# Altium schematic sheet CATS-GS-Overview.SchDoc: CATS Groundstation
size A4; DocumentNumber: Overview; Revision: V1.0; SheetNumber: 1; SheetTotal: 9; Author: Luca Jost; Subtitle: Overview
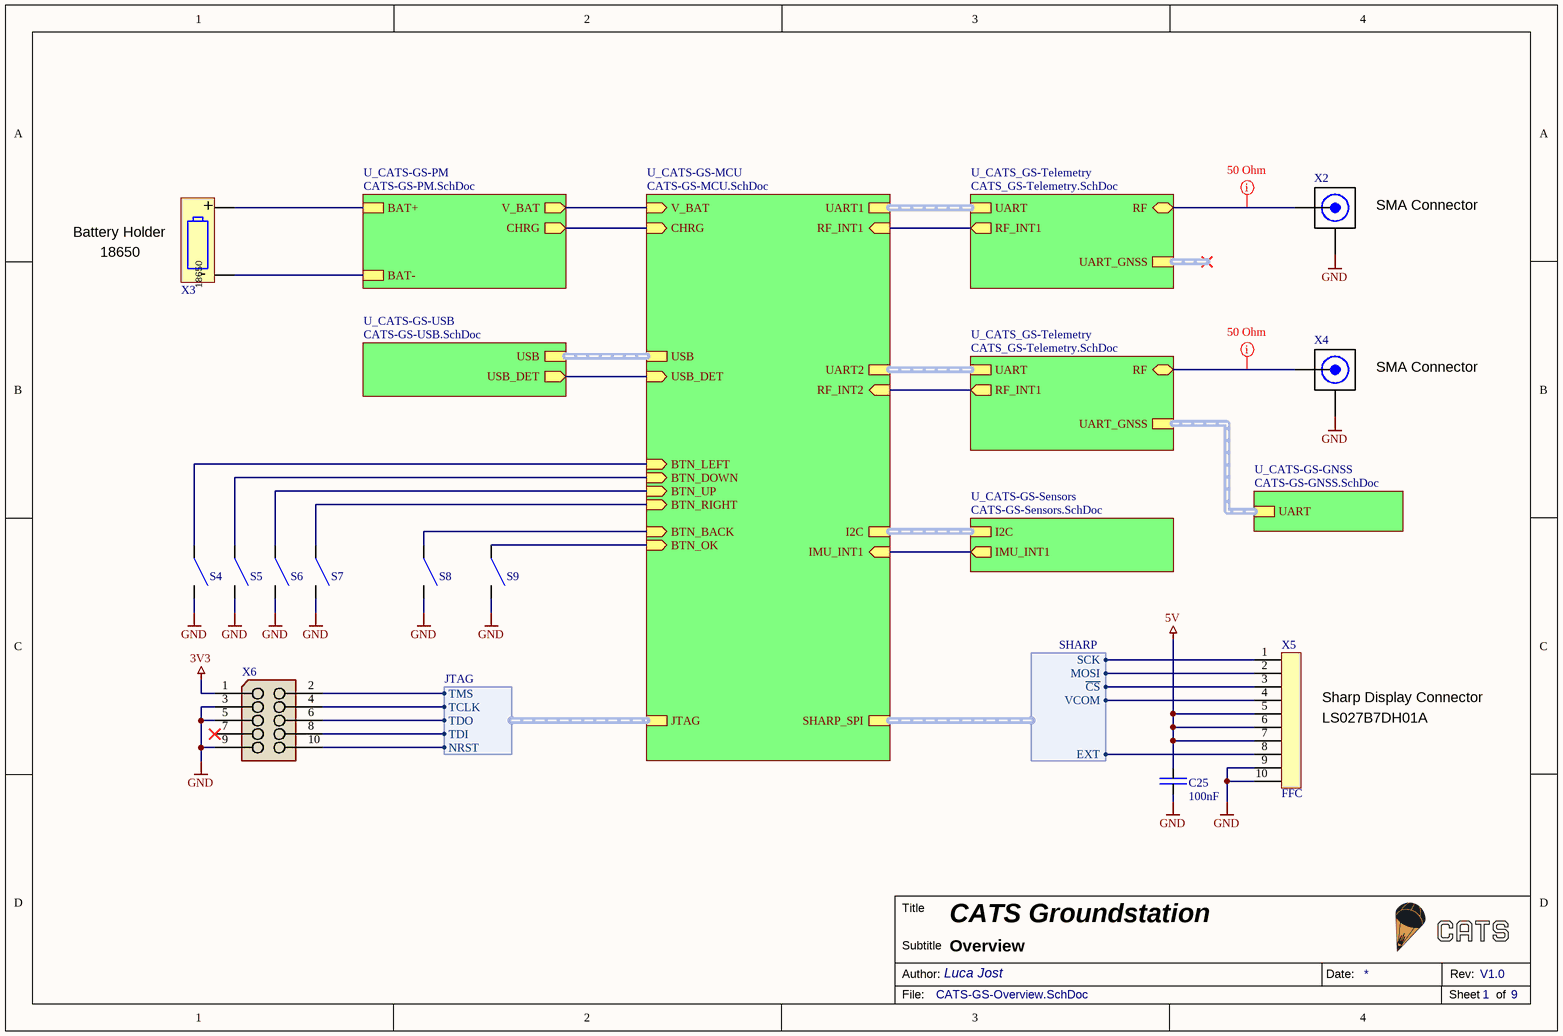
[diagram p0: CATS-GS-Overview.SchDoc]

## Parts
C25  100nF  [SMD Keramikkondensator 0402]
S4  SMD-Button  [SMD Button 4.2x3.2]  (value not drawn)
S5  SMD-Button  [SMD Button 4.2x3.2]  (value not drawn)
S6  SMD-Button  [SMD Button 4.2x3.2]  (value not drawn)
S7  SMD-Button  [SMD Button 4.2x3.2]  (value not drawn)
S8  SMD-Button  [SMD Button 4.2x3.2]  (value not drawn)
S9  SMD-Button  [SMD Button 4.2x3.2]  (value not drawn)
X2  SMA Connector  [SMD Connector SMA]  (value not drawn)
X3  18650  [SMD 18650 Batttery Holder]  (value not drawn)
X4  SMA Connector  [SMD Connector SMA]  (value not drawn)
X5  FFC  [SMD Connector FFC/FPC 10Pin / 0.5mm Pitch]
X6  JTAG-Header (ARM-Cortex)  [SMD Connector 1.27mm (2x5)]  (value not drawn)

## Sub-sheets
U_CATS-GS-GNSS = CATS-GS-GNSS.SchDoc: UART (harness UART)
U_CATS-GS-MCU = CATS-GS-MCU.SchDoc: SHARP_SPI (harness SHARP), USB (harness USB), JTAG (harness JTAG), UART2 (harness UART), UART1 (harness UART), RF_INT1 (in), RF_INT2 (in), I2C, IMU_INT1 (in), USB_DET (in), CHRG (in), V_BAT (in), BTN_OK (in), BTN_BACK (in), BTN_RIGHT (in), BTN_UP (in), BTN_DOWN (in), BTN_LEFT (in)
U_CATS-GS-PM = CATS-GS-PM.SchDoc: BAT+, BAT-, V_BAT (out), CHRG (out)
U_CATS-GS-Sensors = CATS-GS-Sensors.SchDoc: I2C (harness I2C), IMU_INT1 (out)
U_CATS-GS-USB = CATS-GS-USB.SchDoc: USB (harness USB), USB_DET (out)
U_CATS_GS-Telemetry = CATS_GS-Telemetry.SchDoc: UART, RF_INT1 (out), UART_GNSS, RF (bidir)
U_CATS_GS-Telemetry = CATS_GS-Telemetry.SchDoc: UART, RF_INT1 (out), UART_GNSS, RF (bidir)

## Harnesses
JTAG: TMS, TDI, TDO, TCLK, NRST
SHARP: MOSI, ~{CS}, SCK, VCOM, EXT

## Nets
3V3: X6.1
5V: C25.2 X5.5 X5.6 X5.7
GND: C25.1 S4.2 S5.2 S6.2 S7.2 S8.2 S9.2 X2.2(RF) X4.2(RF) X5.9 X5.10 X6.3 X6.5 X6.9
NetS4_1: S4.1 ; sheet U_CATS-GS-MCU/BTN_LEFT
NetS5_1: S5.1 ; sheet U_CATS-GS-MCU/BTN_DOWN
NetS6_1: S6.1 ; sheet U_CATS-GS-MCU/BTN_UP
NetS7_1: S7.1 ; sheet U_CATS-GS-MCU/BTN_RIGHT
NetS8_1: S8.1 ; sheet U_CATS-GS-MCU/BTN_BACK
NetS9_1: S9.1 ; sheet U_CATS-GS-MCU/BTN_OK
NetX2_1: X2.1(RF) ; sheet U_CATS_GS-Telemetry/RF
NetX3_1: X3.1(+) ; sheet U_CATS-GS-PM/BAT+
NetX3_2: X3.2(-) ; sheet U_CATS-GS-PM/BAT-
NetX4_1: X4.1(RF) ; sheet U_CATS_GS-Telemetry/RF
NetX5_1: X5.1 ; sheet U_CATS-GS-MCU/SHARP_SPI.SCK
NetX5_2: X5.2 ; sheet U_CATS-GS-MCU/SHARP_SPI.MOSI
NetX5_3: X5.3 ; sheet U_CATS-GS-MCU/SHARP_SPI.~{CS}
NetX5_4: X5.4 ; sheet U_CATS-GS-MCU/SHARP_SPI.VCOM
NetX5_8: X5.8 ; sheet U_CATS-GS-MCU/SHARP_SPI.EXT
NetX6_2: X6.2 ; sheet U_CATS-GS-MCU/JTAG.TMS
NetX6_4: X6.4 ; sheet U_CATS-GS-MCU/JTAG.TCLK
NetX6_6: X6.6 ; sheet U_CATS-GS-MCU/JTAG.TDO
NetX6_8: X6.8 ; sheet U_CATS-GS-MCU/JTAG.TDI
NetX6_10: X6.10 ; sheet U_CATS-GS-MCU/JTAG.NRST
(unnamed): sheet U_CATS-GS-Sensors/IMU_INT1, sheet U_CATS-GS-MCU/IMU_INT1
(unnamed): sheet U_CATS_GS-Telemetry/RF_INT1, sheet U_CATS-GS-MCU/RF_INT1
(unnamed): sheet U_CATS_GS-Telemetry/RF_INT1, sheet U_CATS-GS-MCU/RF_INT2
(unnamed): sheet U_CATS-GS-PM/V_BAT, sheet U_CATS-GS-MCU/V_BAT
(unnamed): sheet U_CATS-GS-PM/CHRG, sheet U_CATS-GS-MCU/CHRG
(unnamed): sheet U_CATS-GS-USB/USB_DET, sheet U_CATS-GS-MCU/USB_DET

Not connected (* = marked no-connect by the designer): X6 7*

## Buses and harness runs
harness sheet U_CATS-GS-GNSS/UART = sheet U_CATS_GS-Telemetry/UART_GNSS
harness sheet U_CATS-GS-MCU/I2C = sheet U_CATS-GS-Sensors/I2C
harness sheet U_CATS-GS-MCU/UART1 = sheet U_CATS_GS-Telemetry/UART
harness sheet U_CATS-GS-MCU/UART2 = sheet U_CATS_GS-Telemetry/UART
harness sheet U_CATS-GS-MCU/USB = sheet U_CATS-GS-USB/USB

## Layout directives
rule Impedance Constraint [Min = 50.00    Max = 50.00    ]; net class RF-Line 50: NetX2_1, NetX4_1

## Notes on the sheet
- (near X3) Battery Holder
- (near X2) SMA Connector
- 18650
- (near X4) SMA Connector
- (near X5) Sharp Display Connector
- (near X5) LS027B7DH01A
- Title
- Author:
- Subtitle
- Date:
- Rev:
- File:
- Sheet
- of

## Library data of the parts
C25 = E6 - 100nF: SMD Ceramic Capacitor E6; Unit Price: 0.01; JLC: C307331
S4-S9 = Button 4.2mmx3.2mm: Button SPST; LCSC: C139797
X2 X4 = SMA Connector: Female SMA Connector THT; JLC: C496550
X3 = 18650 Battery Holder: Single 18650 Battery Holder; JLC: C2988620; ComponentLink1Description: Datasheet; ComponentLink1URL: https://datasheet.lcsc.com/lcsc/2204021730_MYOUNG-BH-18650-B1BA002_C2988620.pdf
X5 = FPC/FFC 10 Pin / P 0.5: 10 Pin FPC/FFC Connector 0.5mm Pitch, Bottom Contact; JLC: C481219; ComponentLink1Description: Datasheet; ComponentLink1URL: https://datasheet.lcsc.com/lcsc/2001071405_XFCN-F0502-B-10-20T-R_C481219.pdf
X6 = X-JTAG-Header (ARM-Cortex): Component Value: SHF-105-01-L-D-SM (2x5); Digikey: SAM10710-ND; Farnell: 1885915; Mouser: 200-SHF10501LDSM; Unit Price: 2.89; ComponentLink1Description: Datasheet; ComponentLink1URL: https://datasheet.lcsc.com/lcsc/1810170717_UNI-ROYAL-Uniroyal-Elec-4D03WGJ0331T5E_C12018.pdf; Component Description: JTAG-Header (ARM-Cortex)